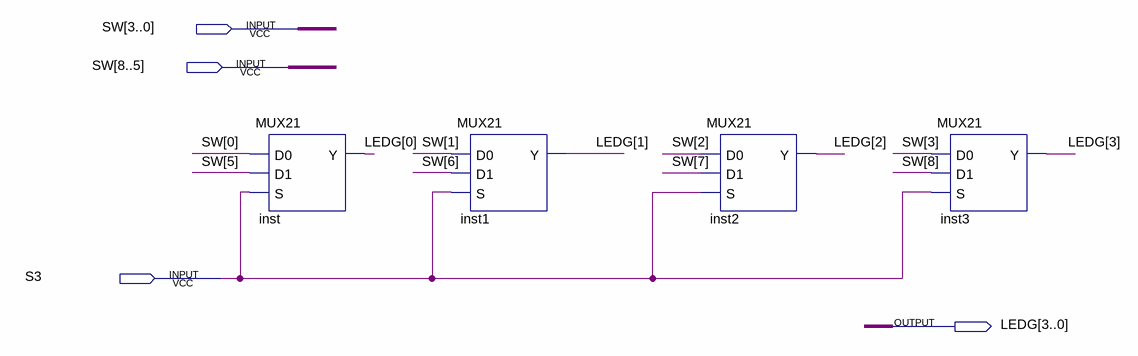
[diagram p0: schematic sheet]
// Quartus schematic MUX4IN.bdf as structural Verilog: 4 symbols, 4 pins
module MUX4IN (
  input  [8:0] SW,
  input  S3,
  output [3:0] LEDG
);

  MUX21 inst (.D0(SW[0]), .D1(SW[5]), .S(S3), .Y(LEDG[0]));
  MUX21 inst1 (.D0(SW[1]), .D1(SW[6]), .S(S3), .Y(LEDG[1]));
  MUX21 inst2 (.D0(SW[2]), .D1(SW[7]), .S(S3), .Y(LEDG[2]));
  MUX21 inst3 (.D0(SW[3]), .D1(SW[8]), .S(S3), .Y(LEDG[3]));
endmodule
